# Altium schematic sheet V_4.SchDoc
size A4
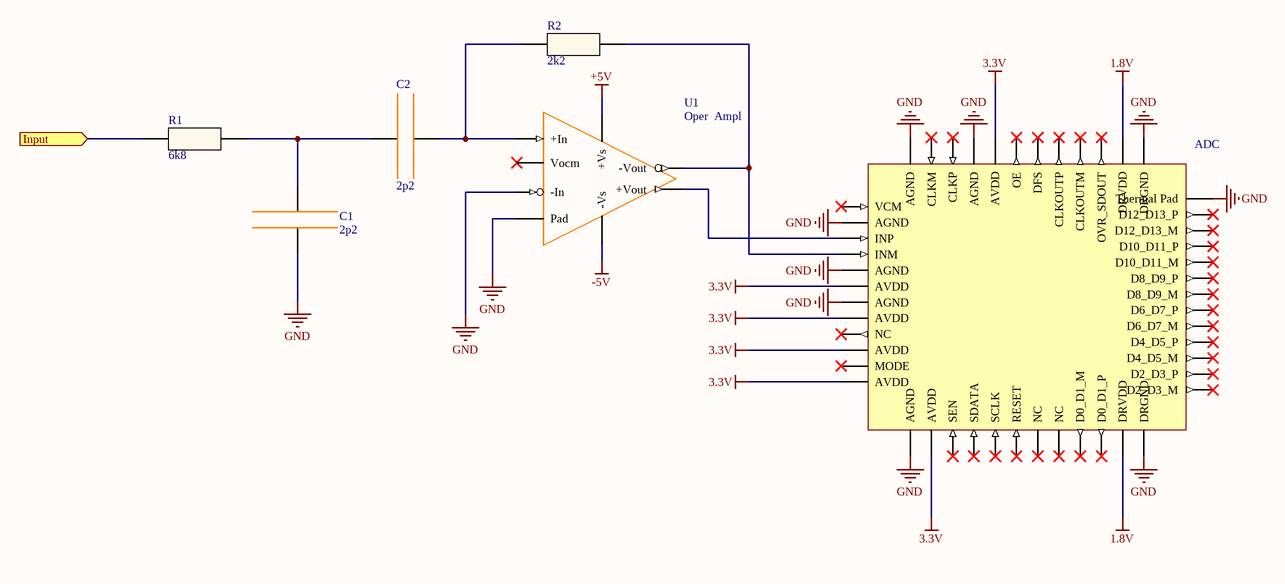
[diagram p0: V_4.SchDoc]

## Parts
C1  2p2  [C0805]
C2  2p2  [C0805]
R1  6k8  [R0805]
R2  2k2  [R0805]
U1  Oper  Ampl  [ADA]
U2  ADC  [ADS]

## Ports
Input (in)

## Nets
1.8V: U2.27(DRVDD) U2.60(DRVDD)
3.3V: U2.33(AVDD) U2.43(AVDD) U2.45(AVDD) U2.47(AVDD) U2.49(AVDD) U2.51(AVDD)
+5V: U1.23(+Vs)
-5V: U1.22(-Vs)
GND: C1.3 U1.20(-In) U1.21(Pad) U2.26(DRGND) U2.34(AGND) U2.37(AGND) U2.39(AGND) U2.42(AGND) U2.44(AGND) U2.50(AGND) U2.61(DRGND) U2.74(Thermal_Pad)
Input: R1.0 ; port Input
NetC1_3: C1.3 C2.2 R1.1
NetC2_3: C2.3 R2.0 U1.18(+In)
NetR2_1: R2.1 U1.24(-Vout) U2.41(INM)
NetU1_25: U1.25(+Vout) U2.40(INP)

Not connected (* = marked no-connect by the designer): U1 19(Vocm)*; U2 28(OVR_SDOUT)* 29(CLKOUTM)* 30(CLKOUTP)* 31(DFS)* 32(OE)* 35(CLKP)* 36(CLKM)* 38(VCM)* 46(NC)* 48(MODE)* 52(SEN)* 53(SDATA)* 54(SCLK)* 55(RESET)* 56(NC)* 57(NC)* 58(D0_D1_M)* 59(D0_D1_P)* 62(D2_D3_M)* 63(D2_D3_P)* 64(D4_D5_M)* 65(D4_D5_P)* 66(D6_D7_M)* 67(D6_D7_P)* 68(D8_D9_M)* 69(D8_D9_P)* 70(D10_D11_M)* 71(D10_D11_P)* 72(D12_D13_M)* 73(D12_D13_P)*

## Library data of the parts
C1 C2 = Capasitor: Value: 2p2
R1 R2 = Resistor: Model: *
  R1: Value: 6k8
  R2: Value: 2k2